# EAGLE schematic BackBreaker_CustomHardware (EAGLE 8.3.2)
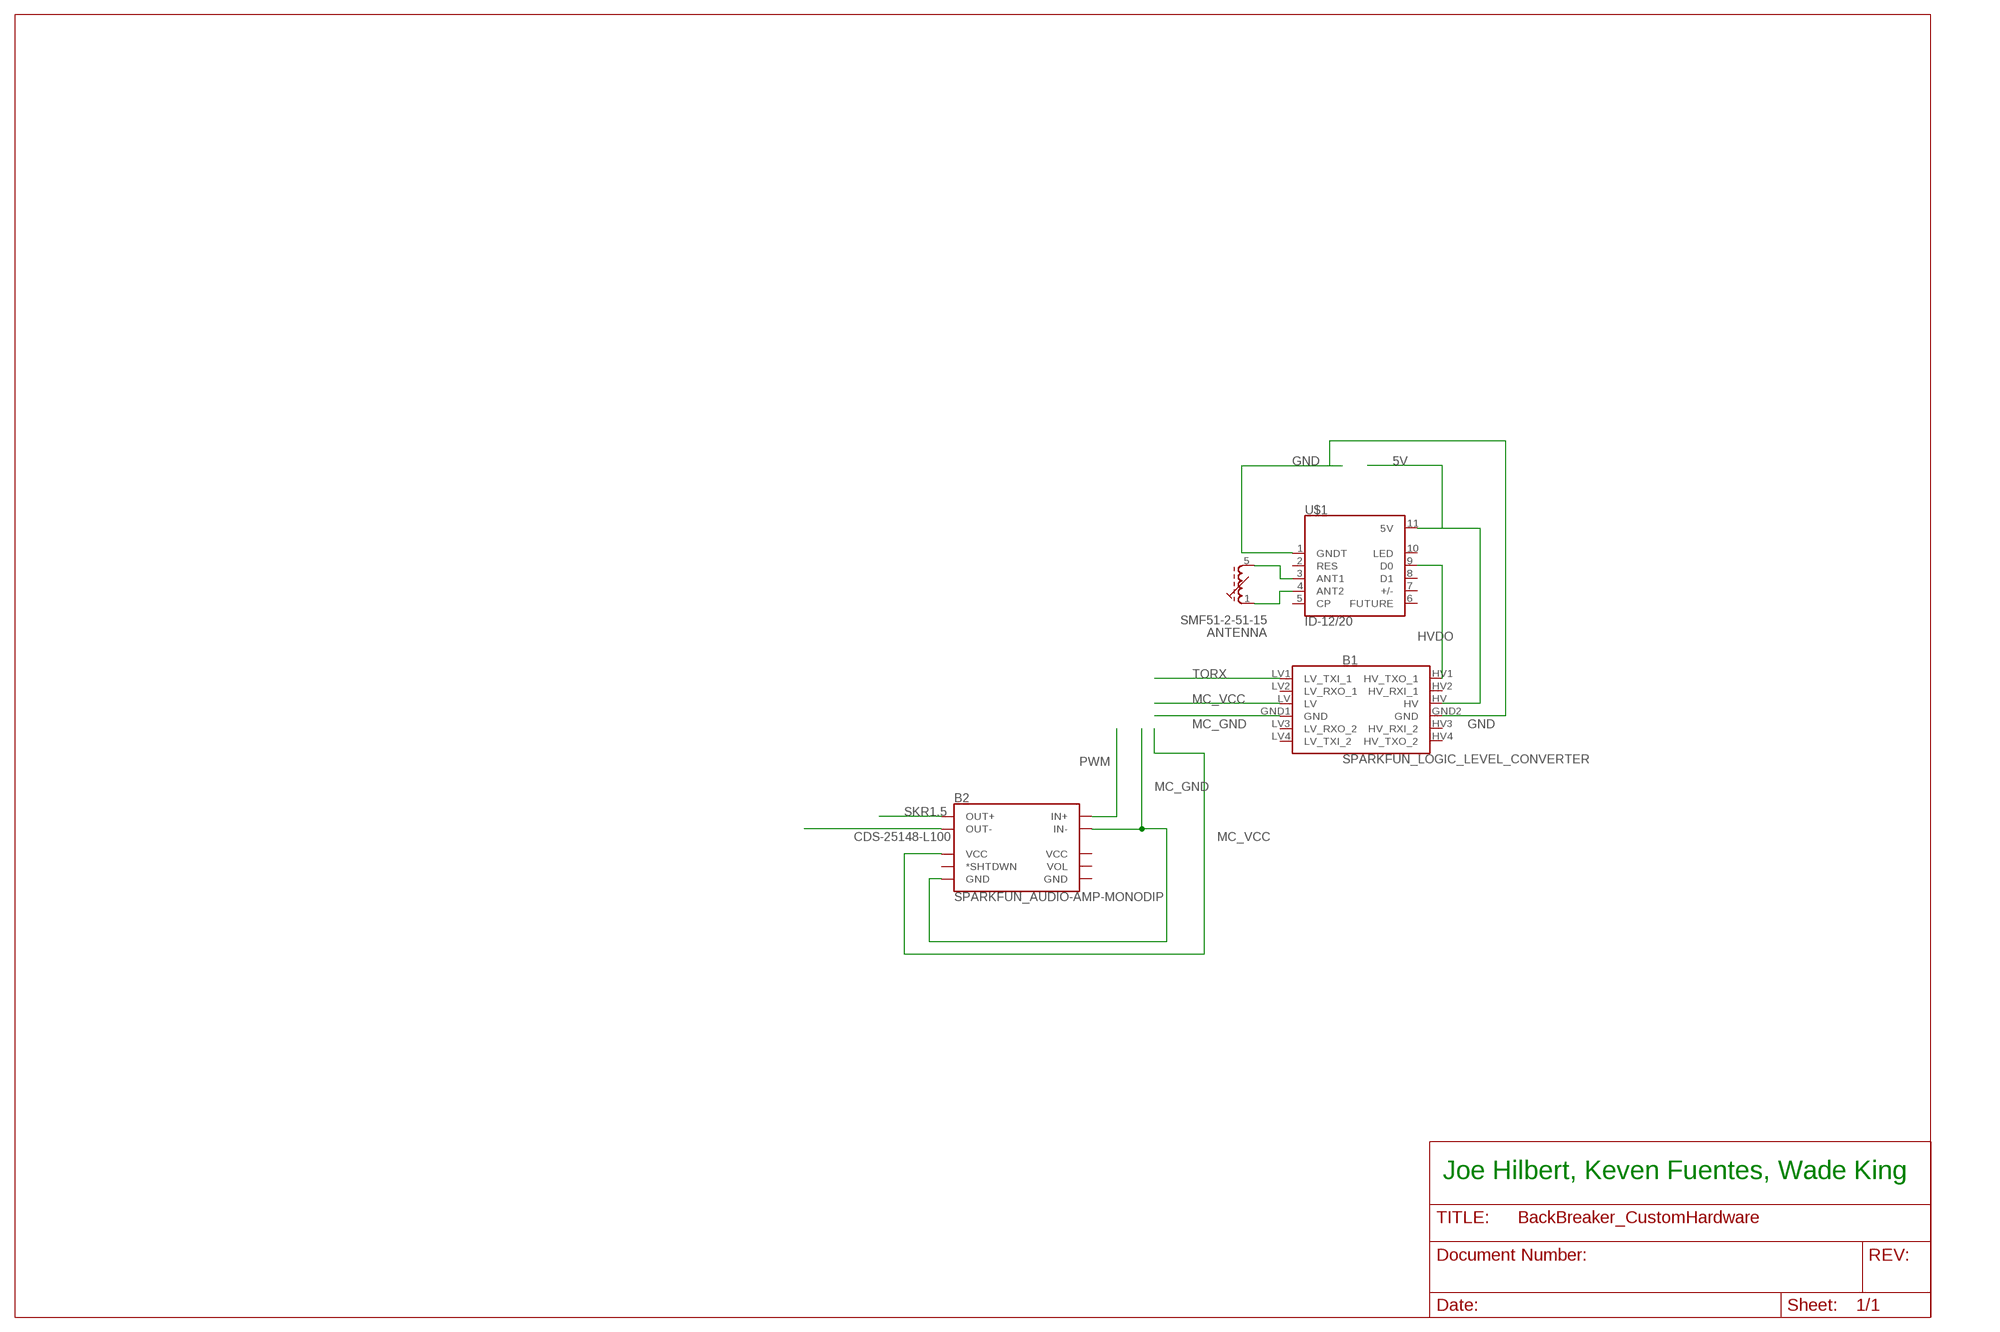
[diagram p0: schematic, sheet 1]

## Parts
ANTENNA  SMF51-2-51-15  [SMF5_1]
B1  SPARKFUN_LOGIC_LEVEL_CONVERTER  [SPARKFUN_LOGIC_LEVEL_CONVERTER]
B2  SPARKFUN_AUDIO-AMP-MONODIP  [AUDIO-AMP-MONO]
U$1  ID-12/20  [ID-12]

## Nets
5V: B1.HV U$1.11(5V)
CDS-25148-L100: B2.OUT-
GND: B1.GND2(GND) U$1.1(GNDT)
HVDO: B1.HV1(HV_TXO_1) U$1.9(D0)
MC_GND: B1.GND1(GND) B2.IN- B2.PWR-(GND)
MC_VCC: B1.LV B2.PWR+(VCC)
N$1: ANTENNA.1(A) U$1.4(ANT2)
N$2: ANTENNA.5(E) U$1.3(ANT1)
PWM: B2.IN+
SKR1.5: B2.OUT+
TORX: B1.LV1(LV_TXI_1)
Unconnected: ANTENNA.S B1.HV2(HV_RXI_1) B1.HV3(HV_RXI_2) B1.HV4(HV_TXO_2) B1.LV2(LV_RXO_1) B1.LV3(LV_RXO_2) B1.LV4(LV_TXI_2) B2.S(*SHTDWN) B2.VOL B2.VOL+(VCC) B2.VOL-(GND) U$1.2(RES) U$1.5(CP) U$1.6(FUTURE) U$1.7(+/-) U$1.8(D1) U$1.10(LED)

## Notes on the sheet
- Joe Hilbert, Keven Fuentes, Wade King

## Library data of the parts
ANTENNA = inductor-neosid:SMF51-2-: RF INDUCTOR SMD tunable RF coil'; OC_FARNELL: unknown; OC_NEWARK: unknown
B1 = SparkFun-Boards:SPARKFUN_LOGIC_LEVEL_CONVERTER: SparkFun Logic Level Converter -Bi-Directional This is the mechnical outline for the 3.3V - 5V bi directional logic level converter. *Note, the "LOCK" Package has the header pins staggered by an offset of 5 mils (off center line), so that when you slide a row of standard 0.1" headers into the PTH pads, it will hold position vertically. See the follwing turorial for more information on this type of special footprints: Sneaky Footprints <https://www.sparkfun.com/tutorials/114> SparkFun Products: SparkFun Logic Level Converter - Bi-Directional <https://www.sparkfun.com/products/12009>
B2 = SparkFun-Boards:SPARKFUN_AUDIO-AMP-MONO: SparkFun Mono Audio Amp Breakout- TPA2005D1 This tiny audio amplifier is based on the Texas Instruments TPA2005D1. Its efficient class-D operation means low heat and long battery life. It can drive an 8-Ohm speaker at up to 1.4 Watts SparkFun Products: Mono Audio Amp Breakout <https://www.sparkfun.com/products/11044>
U$1 = SparkFun-RF:ID-12/20: ID Innovations 125kHz RFID Reader (ID2, ID3, ID12, and ID20) The IDS, ID3, ID12, and ID20 are very simple to use RFID reader modules. Power the module, hold up a 125kHz card, and get a serial string output containing the unique ID of the card. SparkFun Products RFID Reader ID-3LA (125 kHz) <https://www.sparkfun.com/products/11862> (SEN-11862) RFID Reader ID-12LA (125 kHz) <https://www.sparkfun.com/products/11827> (SEN-11827) RFID Reader ID-20LA (125 kHz) <https://www.sparkfun.com/products/11828> (SEN-11828) SparkFun RFID USB Reader <https://www.sparkfun.com/products/9963> (SEN-9963); PROD_ID: CONN-08875